# Altium schematic sheet MAXIM-ADC2.SchDoc
size B
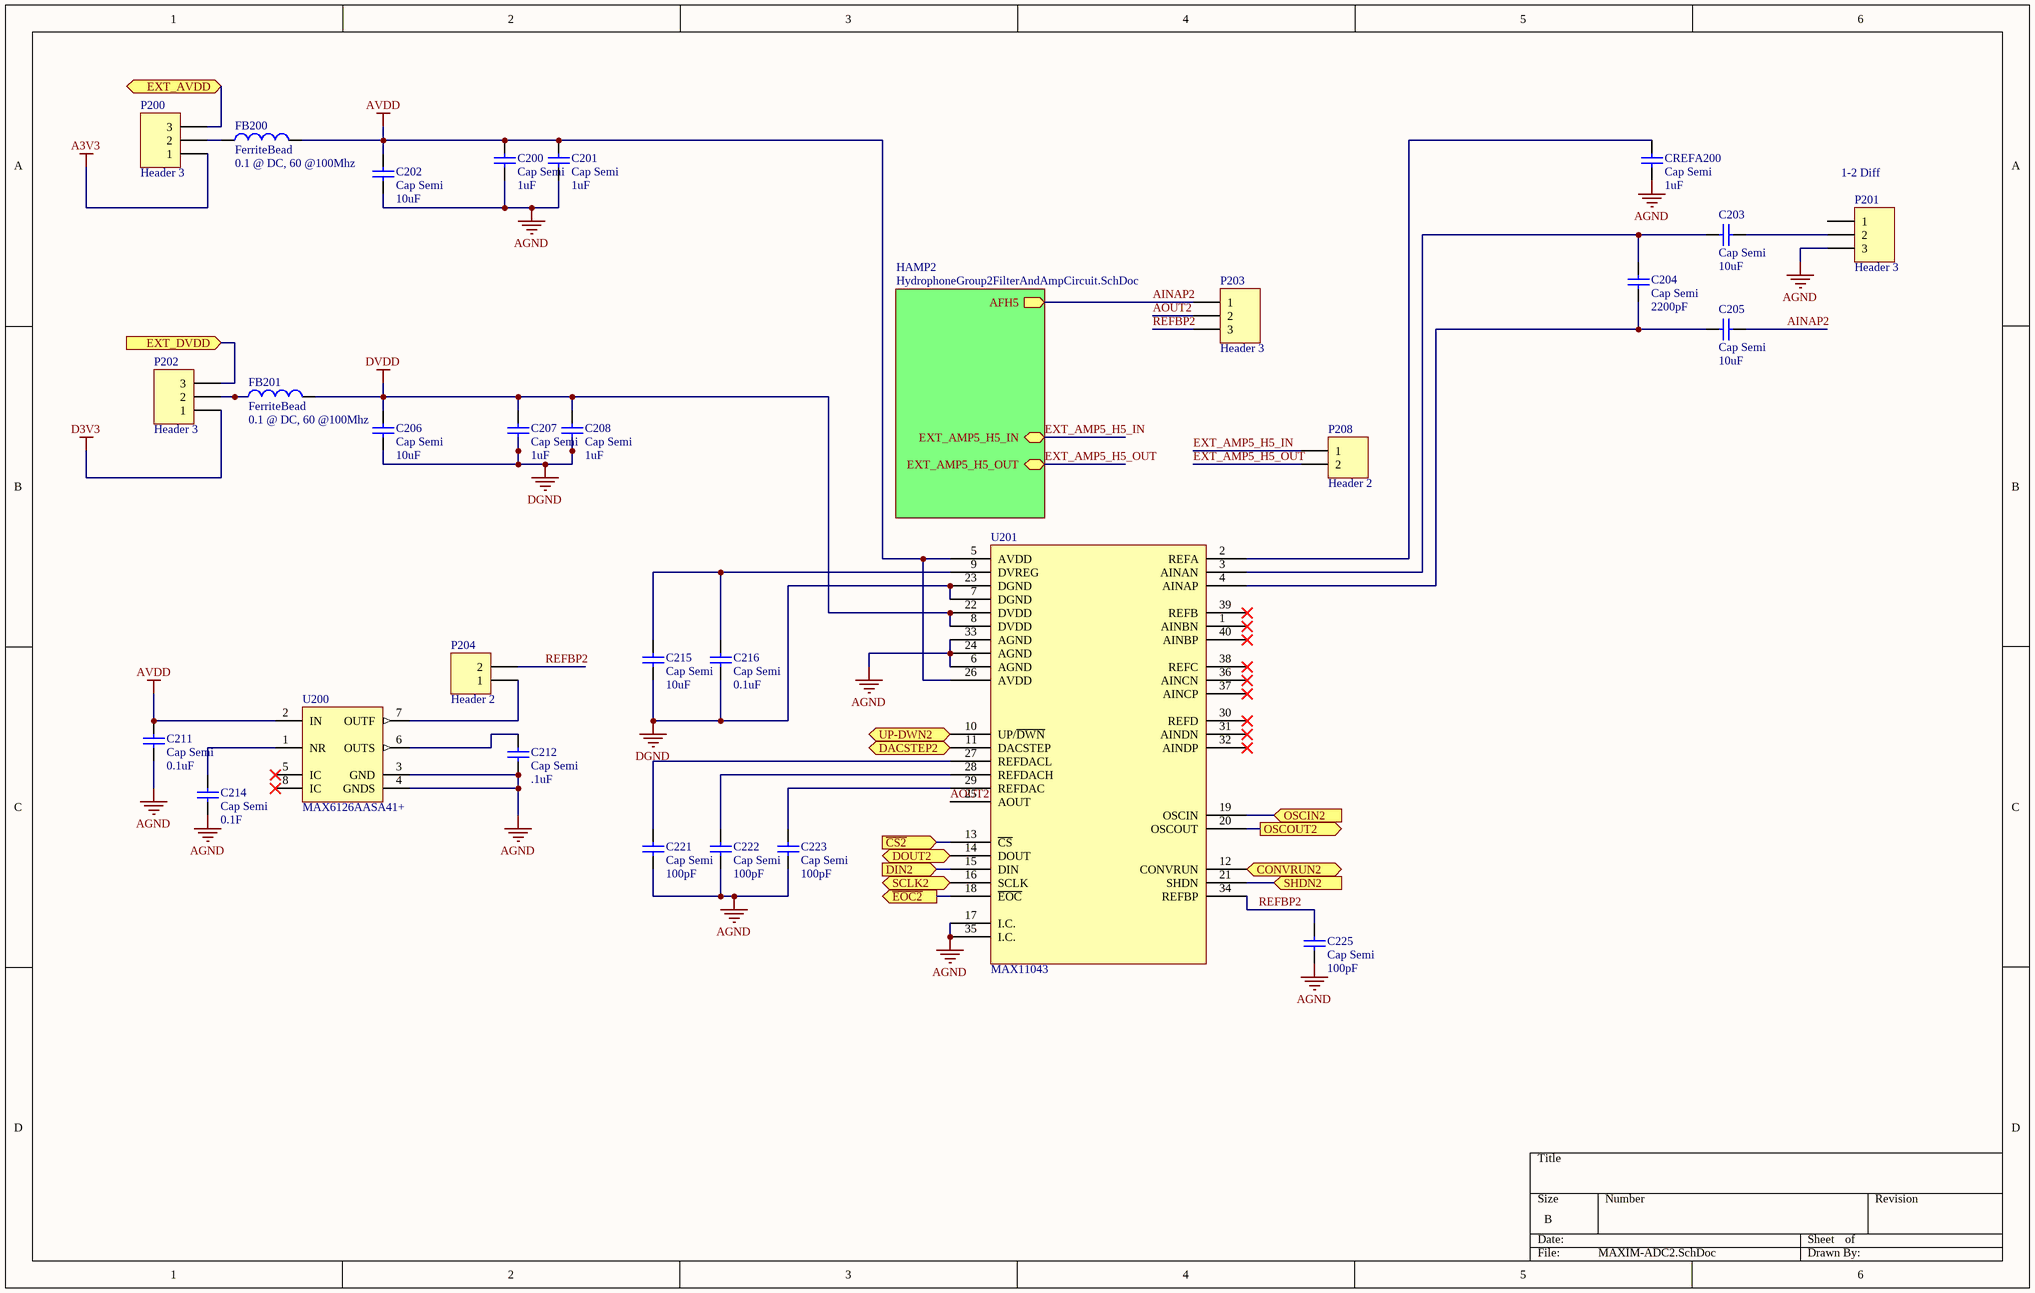
[diagram p0: MAXIM-ADC2.SchDoc]

## Parts
C200  Cap Semi  value 1uF  [1608[0603]]
C201  Cap Semi  value 1uF  [1608[0603]]
C202  Cap Semi  value 10uF  [1608[0603]]
C203  Cap Semi  value 10uF  [1608[0603]]
C204  Cap Semi  value 2200pF  [1608[0603]]
C205  Cap Semi  value 10uF  [1608[0603]]
C206  Cap Semi  value 10uF  [1608[0603]]
C207  Cap Semi  value 1uF  [1608[0603]]
C208  Cap Semi  value 1uF  [1608[0603]]
C211  Cap Semi  value 0.1uF  [1608[0603]]
C212  Cap Semi  value .1uF  [1608[0603]]
C214  Cap Semi  value 0.1F  [1608[0603]]
C215  Cap Semi  value 10uF  [1608[0603]]
C216  Cap Semi  value 0.1uF  [1608[0603]]
C221  Cap Semi  value 100pF  [1608[0603]]
C222  Cap Semi  value 100pF  [1608[0603]]
C223  Cap Semi  value 100pF  [1608[0603]]
C225  Cap Semi  value 100pF  [1608[0603]]
CREFA200  Cap Semi  value 1uF  [1608[0603]]
FB200  FerriteBead  value 0.1 @ DC, 60 @100Mhz  [0603]
FB201  FerriteBead  value 0.1 @ DC, 60 @100Mhz  [0603]
P200  Header 3  [HDR1X3]
P201  Header 3  [HDR1X3]
P202  Header 3  [HDR1X3]
P203  Header 3  [HDR1X3]
P204  Header 2  [HDR1X2]
P208  Header 2  [HDR1X2]
U200  MAX6126AASA41+  [MAXM-S8+4_M]
U201  MAX11043  [QFN50P600X600X80_HS-41N]

## Sub-sheets
HAMP2 = HydrophoneGroup2FilterAndAmpCircuit.SchDoc: AFH5 (out), EXT_AMP5_H5_IN, EXT_AMP5_H5_OUT

## Ports
CONVRUN2 (in), DACSTEP2 (in), DIN2 (in), DOUT2, EXT_AVDD, EXT_DVDD (in), OSCIN2 (in), OSCOUT2 (out), SCLK2 (in), SHDN2 (in), UP-DWN2 (in), ~{CS2} (in), ~{EOC2} (out)

## Nets
A3V3: P200.1
AGND: C200.2 C201.2 C202.2 C211.2 C212.2 C214.2 C221.1 C222.2 C223.1 C225.2 CREFA200.1 P201.3 U200.3(GND) U200.4(GNDS) U201.6(AGND) U201.17(I.C.) U201.24(AGND) U201.33(AGND) U201.35(I.C.)
AVDD: C200.1 C201.1 C202.1 C211.1 FB200.2 U200.2(IN) U201.5(AVDD) U201.26(AVDD)
D3V3: P202.1
DGND: C206.2 C207.2 C208.2 C215.2 C216.2 U201.7(DGND) U201.23(DGND)
DVDD: C206.1 C207.1 C208.1 FB201.2 U201.8(DVDD) U201.22(DVDD)
AINAP2: C205.1 P203.1 ; sheet HAMP2/AFH5
AOUT2: P203.2 U201.25(AOUT)
~{CS2}: U201.13(~{CS}) ; port ~{CS2}
CONVRUN2: U201.12(CONVRUN) ; port CONVRUN2
DACSTEP2: U201.11(DACSTEP) ; port DACSTEP2
DIN2: U201.15(DIN) ; port DIN2
DOUT2: U201.14(DOUT) ; port DOUT2
~{EOC2}: U201.18(~{EOC}) ; port ~{EOC2}
EXT_AMP5_H5_IN: P208.1 ; sheet HAMP2/EXT_AMP5_H5_IN
EXT_AMP5_H5_OUT: P208.2 ; sheet HAMP2/EXT_AMP5_H5_OUT
EXT_AVDD: P200.3 ; port EXT_AVDD
EXT_DVDD: P202.3 ; port EXT_DVDD
OSCIN2: U201.19(OSCIN) ; port OSCIN2
OSCOUT2: U201.20(OSCOUT) ; port OSCOUT2
REFBP2: C225.1 P203.3 P204.2 U201.34(REFBP)
SCLK2: U201.16(SCLK) ; port SCLK2
SHDN2: U201.21(SHDN) ; port SHDN2
UP-DWN2: U201.10(UP/~{DWN}) ; port UP-DWN2
NetC203_1: C203.1 P201.2
NetC203_2: C203.2 C204.2 U201.3(AINAN)
NetC204_1: C204.1 C205.2 U201.4(AINAP)
NetC212_1: C212.1 U200.6(OUTS)
NetC214_1: C214.1 U200.1(NR)
NetC215_1: C215.1 C216.1 U201.9(DVREG)
NetC221_2: C221.2 U201.27(REFDACL)
NetC222_1: C222.1 U201.28(REFDACH)
NetC223_2: C223.2 U201.29(REFDAC)
NetCREFA200_2: CREFA200.2 U201.2(REFA)
NetFB200_1: FB200.1 P200.2
NetFB201_1: FB201.1 P202.2
NetP204_1: P204.1 U200.7(OUTF)

Not connected (* = marked no-connect by the designer): P201 1; U200 5(IC)* 8(IC)*; U201 1(AINBN)* 30(REFD)* 31(AINDN)* 32(AINDP)* 36(AINCN)* 37(AINCP)* 38(REFC)* 39(REFB)* 40(AINBP)*

## Notes on the sheet
- (near P201) 1-2 Diff

## Library data of the parts
C200-C208 C211 C212 C214-C216 C221-C223 C225 CREFA200 = Cap Semi: Capacitor (Semiconductor SIM Model); Published: 8-Jun-2000; LatestRevisionDate: 29-May-2009; LatestRevisionNote: IPC-7351 Footprint Added.; PackageReference: C1206; Publisher: Altium Limited; PackageDescription: Chip Capacitor
FB200 FB201 = Inductor: Code_IEC: 1005; Published: 8-Jun-2000; LatestRevisionDate: 29-May-2009; LatestRevisionNote: IPC-7351 Footprint Added.; PackageReference: 0402-A; Publisher: Altium Limited; PackageDescription: Chip Inductor; Code_JEITA: 0402
P200-P203 = Header 3: Header, 3-Pin; LatestRevisionDate: 17-Jul-2002; LatestRevisionNote: Re-released for DXP Platform.; Publisher: Altium Limited
P204 P208 = Header 2: Header, 2-Pin; LatestRevisionDate: 17-Jul-2002; LatestRevisionNote: Re-released for DXP Platform.; Publisher: Altium Limited
U200 = CMP-0977-00016-1: Ultra-High-Precision, Ultra-Low-Noise, Series Voltage Reference, 4.096 V, -40 to 125 degC, 8-Pin SOIC (S8+4), RoHS, Tube; Manufacturer: Maxim; Output Voltage Accuracy: 0.02% Max.; Line Regulation: 60 uV/V Max.; VOUT: 4.096 V; Dropout Voltage@10 mA: 0.1 V Typ.; VIN: 4.3 to 12.6 V; Operating Temperature: -40 to 125 degC; ComponentLink3URL: http://pdfserv.maximintegrated.com/package_dwgs/21-0041.PDF; PartNumber: MAX6126AASA41+; RoHS: TRUE; ComponentLink3Description: Package Specification; ComponentLink1URL: http://www.maximintegrated.com/; Mounting Technology: Surface Mount; Packing: Tube; DatasheetVersion: Rev. 6; ComponentLink1Description: Manufacturer URL; ComponentLink2URL: http://datasheets.maximintegrated.com/en/ds/MAX6126.pdf; PackageDescription: 8-Pin Small Outline Integrated Circuit Package, Body 4.9 x 3.9 mm, Pitch 1.27 mm; ComponentLink2Description: Datasheet; PackageVersion: Rev. E